# EAGLE design [B]Sensor_Board_Digital_v1.1 (EAGLE 6.4)
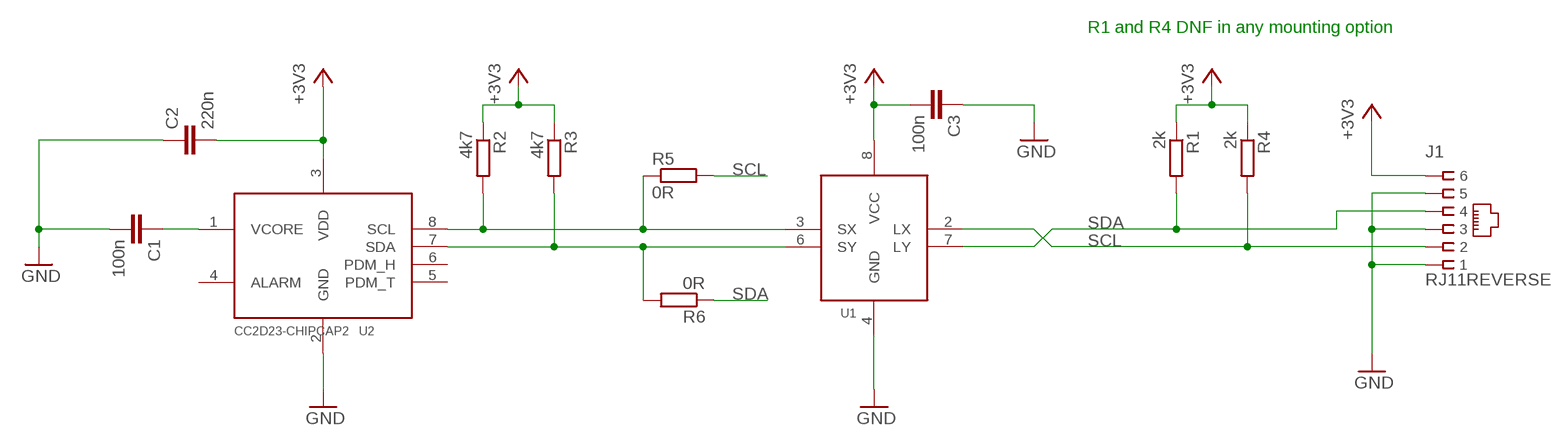
[diagram p0: schematic, sheet 1]

## Parts
C1  100n  C-EUC1206  [C1206]
C2  220n  C-EUC1206  [C1206]
C3  100n  C-EUC1206  [C1206]
J1  RJ11REVERSE  [MX-95001-2661]
R1  2k  R-EU_R1206  [R1206]
R2  4k7  R-EU_R1206  [R1206]
R3  4k7  R-EU_R1206  [R1206]
R4  2k  R-EU_R1206  [R1206]
R5  0R  R-EU_R1206  [R1206]
R6  0R  R-EU_R1206  [R1206]
U1  P82B715_I2C_BUS_EXTENDER  [SO-08]
U2  CC2D23-CHIPCAP2  [CC2D23-CHIPCAP2]

## Nets
+3V3: C2.2 C3.2 J1.6 R1.1 R2.1 R3.1 R4.1 U1.8(VCC) U2.3(VDD)
GND: C1.2 C2.1 C3.1 J1.1 J1.3 J1.5 U1.4(GND) U2.2(GND)
N$1: C1.1 U2.1(VCORE)
N$4: R2.2 R5.1 U1.3(SX) U2.8(SCL)
N$6: R3.2 R6.2 U1.6(SY) U2.7(SDA)
SCL: J1.2 R4.2 R5.2 U1.2(LX)
SDA: J1.4 R1.2 R6.1 U1.7(LY)
Unconnected: U2.4(ALARM) U2.5(PDM_T) U2.6(PDM_H)

## Notes on the sheet
- R1 and R4 DNF in any mounting option

## Library data of the parts
C1-C3 = rcl:C-EU: CAPACITOR, European symbol
J1 = Thomas Egnal Library:RJ11REVERSE
R1-R6 = rcl:R-EU_: RESISTOR, European symbol
U1 = Thomas Egnal Library:P82B715_I2C_BUS_EXTENDER
U2 = Thomas Egnal Library:CC2D23-CHIPCAP2

## Board
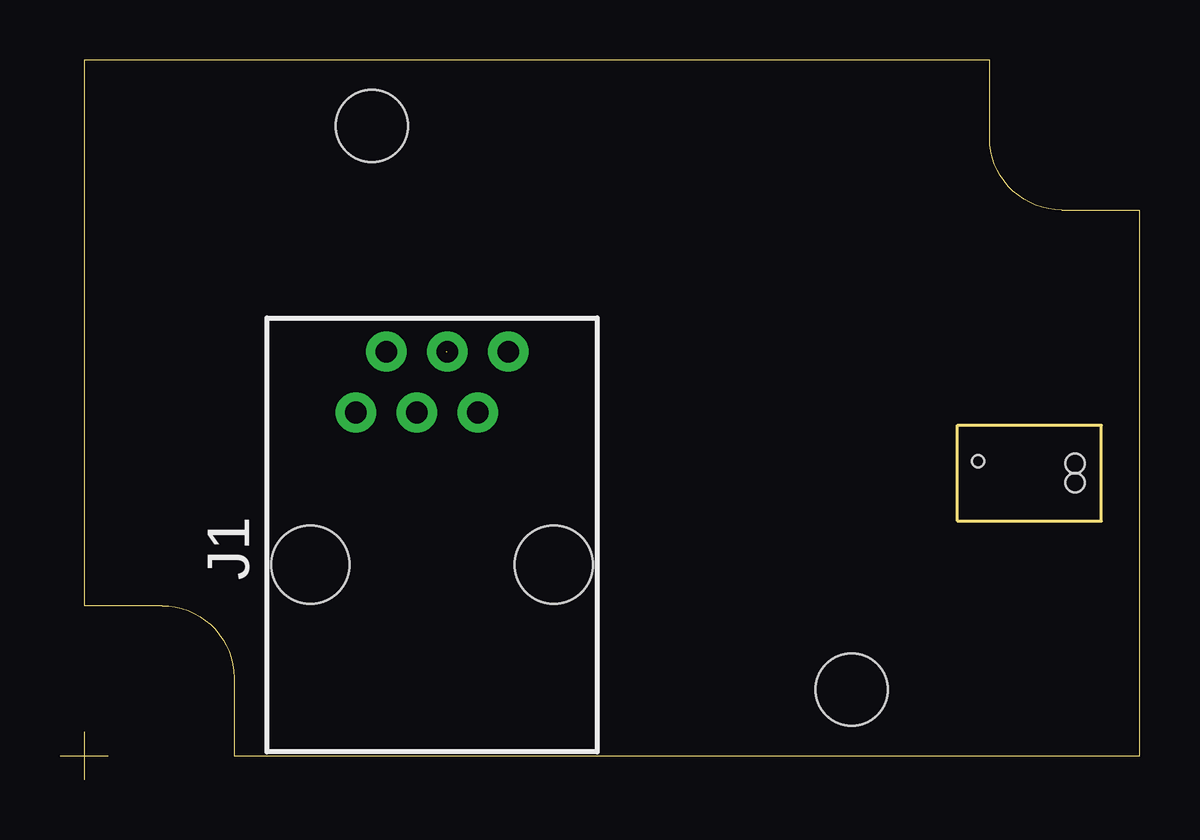
[diagram p1: board, top side]
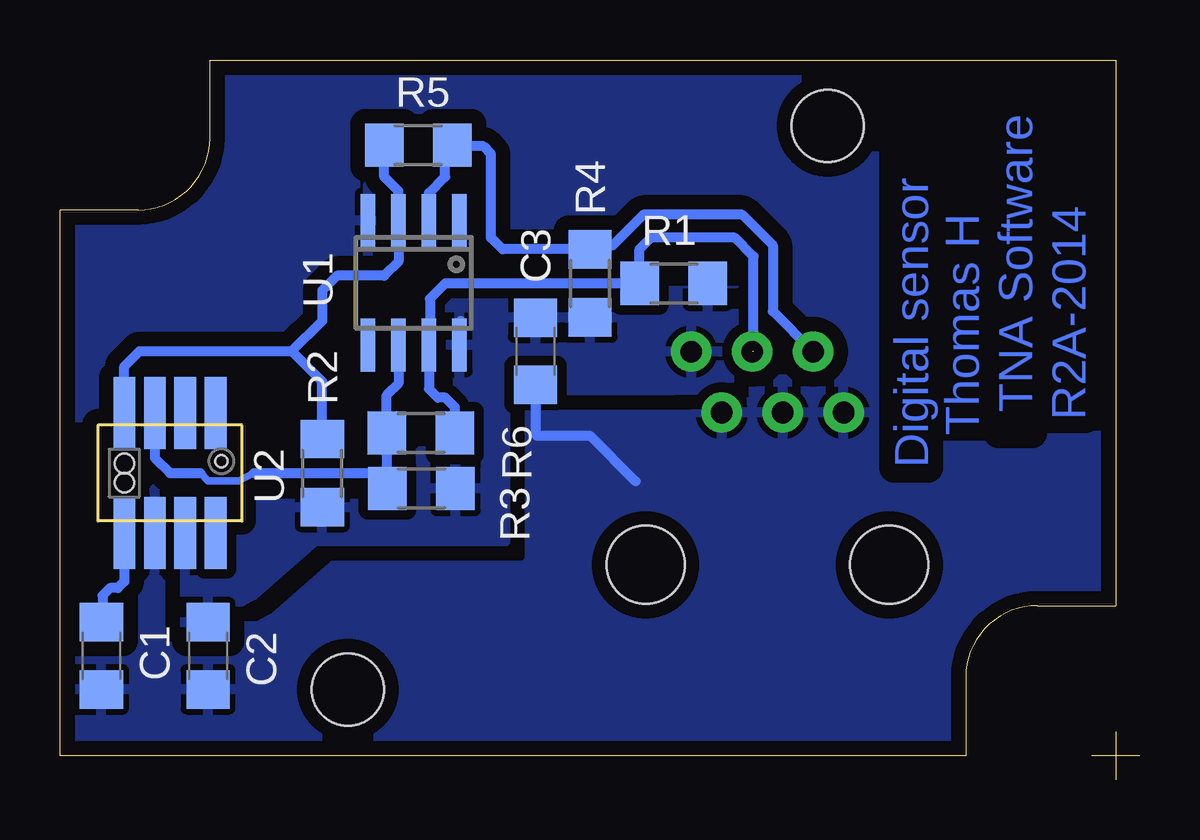
[diagram p2: board, bottom side, seen from below]

Size 45 x 30 mm. Coordinates in mm from the lower left corner, seen from the top.
Outline: 1,2 1,0
Outline: 0,1 2,1
Outline: 7.25,1 45,1 45,23.75 41.75,23.75 arc-90 38.75,26.75 38.75,30 1,30 1,7.25 4.25,7.25 arc-90 7.25,4.25 7.25,1
Copper layers (1*16): Top 0.0356mm / dielectric 1.5011mm / Bottom 0.0356mm
Design rules "default": minimum track width 7mil, minimum drill 14mil, track to track 7mil, track to pad 7mil, pad to pad 7mil, via to via 7mil, smd to smd 0mil, copper to edge 20mil, drill to drill 8mil, minimum pad ring 10mil, minimum via ring 8mil, stop-mask expansion 4mil, vias tented up to drill 0mil, thermal gap 10mil
Holes 3 mm at 13,27.25 33,3.75

### Footprints (pad centres in the part's own frame; a part is rotated, then mirrored left to right if it is on the bottom)
C1206 = smd 1.6 x 1.8: 1 -1.4,0; 2 1.4,0
MX-95001-2661 = drill 0.9 pad 1.676: 1 -3.175,6.35; 2 -1.905,8.89; 3 -0.635,6.35; 4 0.635,8.89; 5 1.905,6.35; 6 3.175,8.89 | hole 3.251: -5.08,0; 5.08,0
R1206 = smd 1.6 x 1.803: 1 -1.422,0; 2 1.422,0
SO-08 = smd 0.6 x 2.2: 1 -1.905,-2.6; 2 -0.635,-2.6; 3 0.635,-2.6; 4 1.905,-2.6; 5 1.905,2.6; 6 0.635,2.6; 7 -0.635,2.6; 8 -1.905,2.6
CC2D23-CHIPCAP2 = smd 3 x 0.9: 1 -2.5,1.905; 2 -2.5,0.635; 3 -2.5,-0.635; 4 -2.5,-1.905; 5 2.5,-1.905; 6 2.5,-0.635; 7 2.5,0.635; 8 2.5,1.905 | hole 0.8: -0.4,1.905; 0.4,1.905 | hole 0.5: 0.5,-2.15

### Placement (x,y rotation side)
C1  43.27,5.16 270 bottom
C2  38.83,5.16 90 bottom
C3  25.18,17.86 90 bottom
J1  15.51,8.95 0 top
R1  19.41,20.68 180 bottom
R2  34.06,12.78 90 bottom
R3  29.94,12.14 180 bottom
R4  22.91,20.68 90 bottom
R5  30.07,26.45 0 bottom
R6  29.96,14.45 180 bottom
U1  30.25,20.71 180 bottom
U2  40.41,12.78 90 bottom

### Tracks (layer width: path | path; a pad name or v marks a point on that pad's centre or on a via)
+3V3
  Bottom 0.406: 28.29,19.12 U1.8 | 25.3,19.12 C3.2
  pour Bottom (isolate 0.406): 28.98,20.39 16.09,20.39 16,16.27 20.49,16.2 24.35,16.22 26.45,16.27 26.45,9.92 34.38,9.92 36.92,7.7 39.78,6.11 39.78,9.6 37.88,11.51 32.16,11.51 29.62,14.04 29.62,15.95 28.98,16.59
GND
  Bottom 0.406: C3.1 25.18,14.38 25.13,14.34 22.91,14.34 21,12.43
  pour Bottom (isolate 0.61, rank 2): 0.87,30.03 0.87,1.02 44.97,1.02 44.97,30.03
N$1
  Bottom 0.406: U2.1 42.32,8.26 42.59,7.99 42.91,7.99 43.23,7.67 43.23,6.6 C1.1
N$4
  Bottom 0.406: U2.8 42.32,17.22 41.69,17.86 35.34,17.86 | 35.34,17.86 34.06,19.12 34.06,20.39 33.46,21 31.48,21 30.89,21.59 U1.3 30.89,24.54 31.48,25.13 R5.1 | R2.2 34.06,16.59 35.34,17.86
N$6
  Bottom 0.305: 39.15,12.78 38.83,12.46 37.56,12.46 36.92,12.78
  Bottom 0.406: U2.7 41.05,13.41 40.41,12.78 39.15,12.78 | U1.6 30.89,16.51 31.38,16.02 R6.2 31.38,12.75 | 31.38,12.75 31.38,12.16 R3.2 | 36.92,12.78 31.82,12.78 31.48,12.43 | 31.48,12.43 31.65,12.43 | 31.48,12.43 31.48,12.65 31.38,12.75
SCL
  Bottom 0.406: 29.57,24.22 U1.2 29.62,24.45 28.94,25.13 28.94,26.16 R5.2 28.59,26.4 27.35,26.4 27.04,26.08 27.04,22.59 26.55,22.11 R4.2 22.74,22.27 21.95,22.27 20.68,23.54 16.56,23.54 15.29,22.27 15.29,19.52 J1.2
SDA  (1 unrouted)
  Bottom 0.406: 16.09,17.84 16.09,21.8 16.88,22.59 20.37,22.59 20.84,22.12 R1.2 28.94,20.68 29.57,20.05 29.57,18.16 U1.7 | 29.57,19.11 U1.7 | R6.1 28.54,15.52 28.94,15.92 29.26,15.92 29.62,16.29 U1.7

### Text on the board
Bottom: TNA Software | R2A-2014 | Thomas H | Digital sensor